# Altium project RegistrationModule.PrjPCB (part 1 of 4)
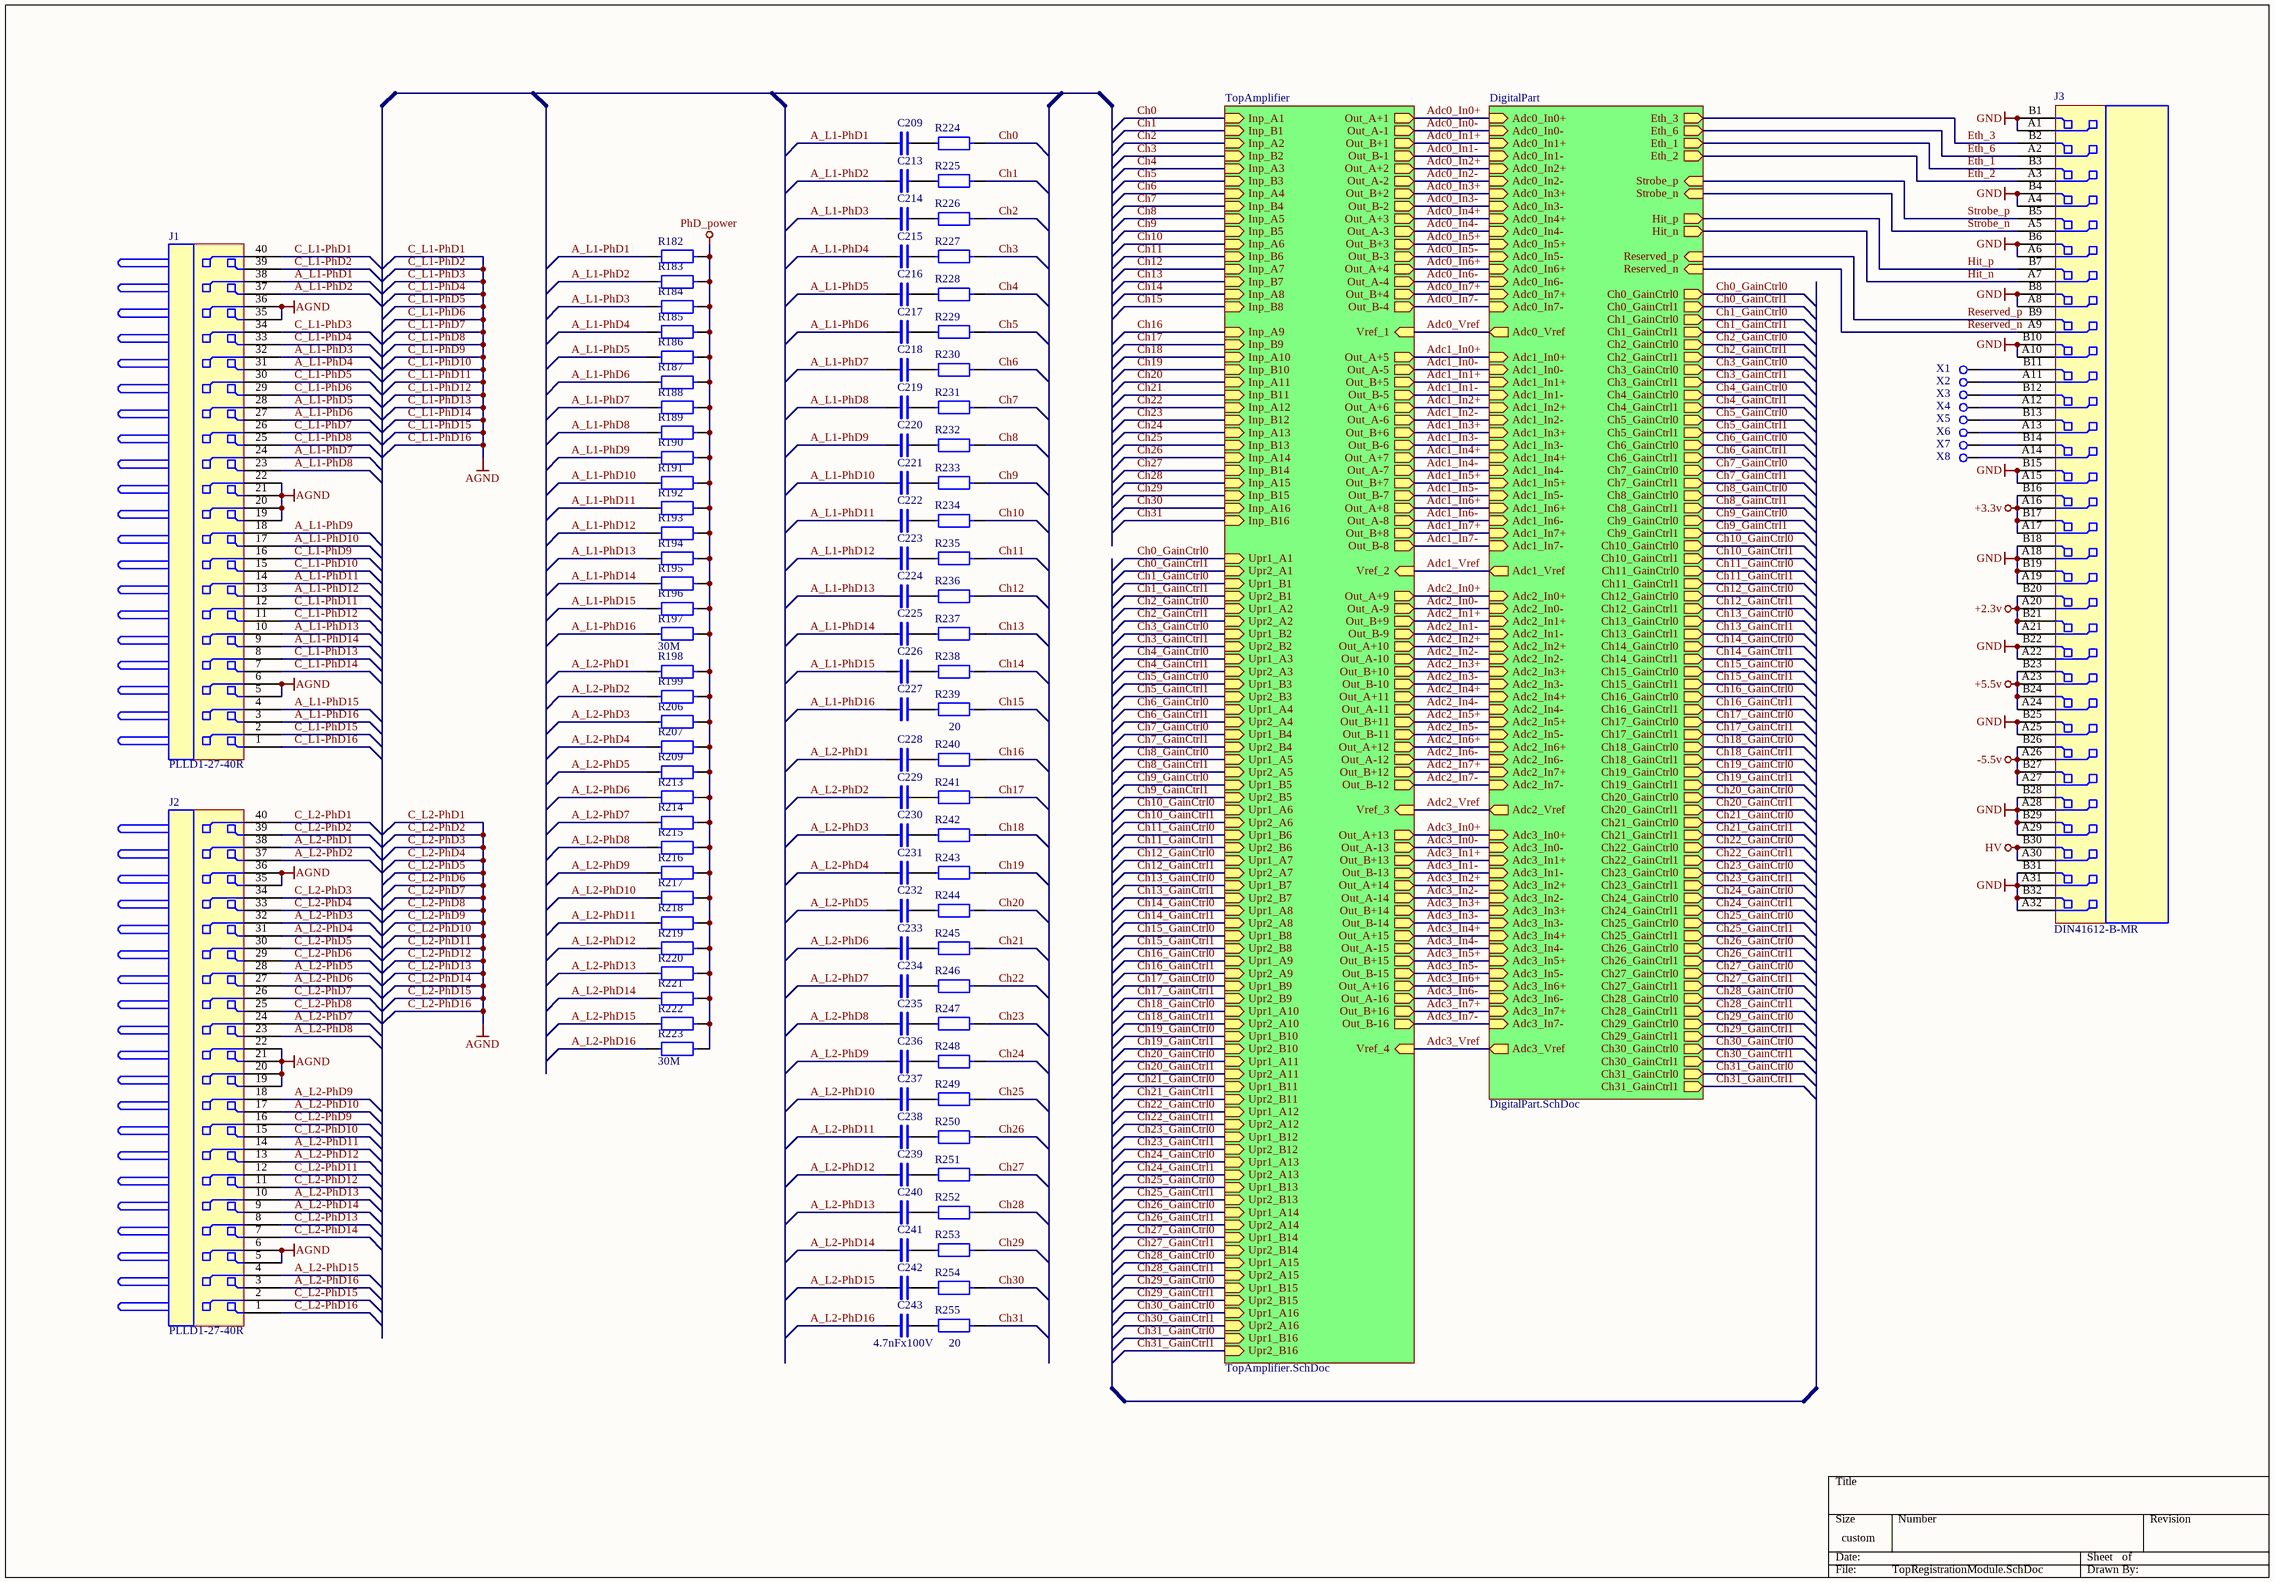
[diagram p0: TopRegistrationModule.SchDoc]
11 sheets, 2487 parts. Net scope: hierarchical (ports join the sheet entries above them; power ports are global).
Board file: RegistrationModule.PcbDoc
Sheets:
  TopRegistrationModule.SchDoc
    DigitalPart = DigitalPart.SchDoc
      Misc = Misc.SchDoc
      PowerMeasure = PowerMeasure.SchDoc
      Nonvolatile RAM = Memory.SchDoc
      ADC_0 = ADC.SchDoc
      ADC_1 = ADC.SchDoc
      ADC_2 = ADC.SchDoc
      ADC_3 = ADC.SchDoc
      Power = Power.SchDoc
      FPGA = FPGA.SchDoc
      Ethernet = Ethernet.SchDoc
    TopAmplifier = TopAmplifier.SchDoc
      CH1 = Amplifier2ch.SchDoc
      CH2 = Amplifier2ch.SchDoc
      CH3 = Amplifier2ch.SchDoc
      CH4 = Amplifier2ch.SchDoc
      CH5 = Amplifier2ch.SchDoc
      CH6 = Amplifier2ch.SchDoc
      CH7 = Amplifier2ch.SchDoc
      CH8 = Amplifier2ch.SchDoc
      CH9 = Amplifier2ch.SchDoc
      CH10 = Amplifier2ch.SchDoc
      CH11 = Amplifier2ch.SchDoc
      CH12 = Amplifier2ch.SchDoc
      CH13 = Amplifier2ch.SchDoc
      CH14 = Amplifier2ch.SchDoc
      CH15 = Amplifier2ch.SchDoc
      CH16 = Amplifier2ch.SchDoc

## Sheet TopRegistrationModule.SchDoc
size 457 x 317 mm

### Parts
C209  4.7nFx100V  [0805]  (value not drawn)
C213  4.7nFx100V  [0805]  (value not drawn)
C214  4.7nFx100V  [0805]  (value not drawn)
C215  4.7nFx100V  [0805]  (value not drawn)
C216  4.7nFx100V  [0805]  (value not drawn)
C217  4.7nFx100V  [0805]  (value not drawn)
C218  4.7nFx100V  [0805]  (value not drawn)
C219  4.7nFx100V  [0805]  (value not drawn)
C220  4.7nFx100V  [0805]  (value not drawn)
C221  4.7nFx100V  [0805]  (value not drawn)
C222  4.7nFx100V  [0805]  (value not drawn)
C223  4.7nFx100V  [0805]  (value not drawn)
C224  4.7nFx100V  [0805]  (value not drawn)
C225  4.7nFx100V  [0805]  (value not drawn)
C226  4.7nFx100V  [0805]  (value not drawn)
C227  4.7nFx100V  [0805]  (value not drawn)
C228  4.7nFx100V  [0805]  (value not drawn)
C229  4.7nFx100V  [0805]  (value not drawn)
C230  4.7nFx100V  [0805]  (value not drawn)
C231  4.7nFx100V  [0805]  (value not drawn)
C232  4.7nFx100V  [0805]  (value not drawn)
C233  4.7nFx100V  [0805]  (value not drawn)
C234  4.7nFx100V  [0805]  (value not drawn)
C235  4.7nFx100V  [0805]  (value not drawn)
C236  4.7nFx100V  [0805]  (value not drawn)
C237  4.7nFx100V  [0805]  (value not drawn)
C238  4.7nFx100V  [0805]  (value not drawn)
C239  4.7nFx100V  [0805]  (value not drawn)
C240  4.7nFx100V  [0805]  (value not drawn)
C241  4.7nFx100V  [0805]  (value not drawn)
C242  4.7nFx100V  [0805]  (value not drawn)
C243  4.7nFx100V  [0805]
J1  PLLD1-27-40R  [PLLD1-27-40R]
J2  PLLD1-27-40R  [PLLD1-27-40R]
J3  DIN41612-B-MR  [DIN41612-B-MR]
R182  30M  [0805]  (value not drawn)
R183  30M  [0805]  (value not drawn)
R184  30M  [0805]  (value not drawn)
R185  30M  [0805]  (value not drawn)
R186  30M  [0805]  (value not drawn)
R187  30M  [0805]  (value not drawn)
R188  30M  [0805]  (value not drawn)
R189  30M  [0805]  (value not drawn)
R190  30M  [0805]  (value not drawn)
R191  30M  [0805]  (value not drawn)
R192  30M  [0805]  (value not drawn)
R193  30M  [0805]  (value not drawn)
R194  30M  [0805]  (value not drawn)
R195  30M  [0805]  (value not drawn)
R196  30M  [0805]  (value not drawn)
R197  30M  [0805]
R198  30M  [0805]  (value not drawn)
R199  30M  [0805]  (value not drawn)
R206  30M  [0805]  (value not drawn)
R207  30M  [0805]  (value not drawn)
R209  30M  [0805]  (value not drawn)
R213  30M  [0805]  (value not drawn)
R214  30M  [0805]  (value not drawn)
R215  30M  [0805]  (value not drawn)
R216  30M  [0805]  (value not drawn)
R217  30M  [0805]  (value not drawn)
R218  30M  [0805]  (value not drawn)
R219  30M  [0805]  (value not drawn)
R220  30M  [0805]  (value not drawn)
R221  30M  [0805]  (value not drawn)
R222  30M  [0805]  (value not drawn)
R223  30M  [0805]
R224  20  [0603]  (value not drawn)
R225  20  [0603]  (value not drawn)
R226  20  [0603]  (value not drawn)
R227  20  [0603]  (value not drawn)
R228  20  [0603]  (value not drawn)
R229  20  [0603]  (value not drawn)
R230  20  [0603]  (value not drawn)
R231  20  [0603]  (value not drawn)
R232  20  [0603]  (value not drawn)
R233  20  [0603]  (value not drawn)
R234  20  [0603]  (value not drawn)
R235  20  [0603]  (value not drawn)
R236  20  [0603]  (value not drawn)
R237  20  [0603]  (value not drawn)
R238  20  [0603]  (value not drawn)
R239  20  [0603]
R240  20  [0603]  (value not drawn)
R241  20  [0603]  (value not drawn)
R242  20  [0603]  (value not drawn)
R243  20  [0603]  (value not drawn)
R244  20  [0603]  (value not drawn)
R245  20  [0603]  (value not drawn)
R246  20  [0603]  (value not drawn)
R247  20  [0603]  (value not drawn)
R248  20  [0603]  (value not drawn)
R249  20  [0603]  (value not drawn)
R250  20  [0603]  (value not drawn)
R251  20  [0603]  (value not drawn)
R252  20  [0603]  (value not drawn)
R253  20  [0603]  (value not drawn)
R254  20  [0603]  (value not drawn)
R255  20  [0603]
X1  TP_nPD  [DRL06]  (value not drawn)
X2  TP_nPD  [DRL06]  (value not drawn)
X3  TP_nPD  [DRL06]  (value not drawn)
X4  TP_nPD  [DRL06]  (value not drawn)
X5  TP_nPD  [DRL06]  (value not drawn)
X6  TP_nPD  [DRL06]  (value not drawn)
X7  TP_nPD  [DRL06]  (value not drawn)
X8  TP_nPD  [DRL06]  (value not drawn)

### Sub-sheets
DigitalPart = DigitalPart.SchDoc: Adc0_In0+ (in), Adc0_In1+ (in), Adc0_In2+ (in), Adc0_In3+ (in), Adc0_In4+ (in), Adc0_In5+ (in), Adc0_In6+ (in), Adc0_In7+ (in), Adc0_Vref (out), Adc0_In0- (in), Adc0_In1- (in), Adc0_In2- (in), Adc0_In3- (in), Adc0_In4- (in), Adc0_In5- (in), Adc0_In6- (in), Adc0_In7- (in), Adc1_In0+ (in), Adc1_In1+ (in), Adc1_In2+ (in), Adc1_In3+ (in), Adc1_In4+ (in), Adc1_In5+ (in), Adc1_In6+ (in), Adc1_In7+ (in), Adc1_Vref (out), Adc1_In0- (in), Adc1_In1- (in), Adc1_In2- (in), Adc1_In3- (in), Adc1_In4- (in), Adc1_In5- (in), Adc1_In6- (in), Adc1_In7- (in), Adc2_In0+ (in), Adc2_In1+ (in), Adc2_In2+ (in), Adc2_In3+ (in), Adc2_In4+ (in), Adc2_In5+ (in), Adc2_In6+ (in), Adc2_In7+ (in), Adc2_Vref (out), Adc2_In0- (in), Adc2_In1- (in), Adc2_In2- (in), Adc2_In3- (in), Adc2_In4- (in), Adc2_In5- (in), Adc2_In6- (in), Adc2_In7- (in), Adc3_In0+ (in), Adc3_In1+ (in), Adc3_In2+ (in), Adc3_In3+ (in), Adc3_In4+ (in), Adc3_In5+ (in), Adc3_In6+ (in), Adc3_In7+ (in), Adc3_Vref (out), Adc3_In0- (in), Adc3_In1- (in), Adc3_In2- (in), Adc3_In3- (in), Adc3_In4- (in), Adc3_In5- (in), Adc3_In6- (in), Adc3_In7- (in), Ch0_GainCtrl0 (out), Ch1_GainCtrl0 (out), Ch2_GainCtrl0 (out), Ch3_GainCtrl0 (out), Ch4_GainCtrl0 (out), Ch5_GainCtrl0 (out), Ch6_GainCtrl0 (out), Ch7_GainCtrl0 (out), Ch8_GainCtrl0 (out), Ch9_GainCtrl0 (out), Ch10_GainCtrl0 (out), Ch11_GainCtrl0 (out), Ch12_GainCtrl0 (out), Ch13_GainCtrl0 (out), Ch14_GainCtrl0 (out), Ch15_GainCtrl0 (out), Ch16_GainCtrl0 (out), Ch17_GainCtrl0 (out), Ch18_GainCtrl0 (out), Ch19_GainCtrl0 (out), Ch20_GainCtrl0 (out), Ch21_GainCtrl0 (out), Ch22_GainCtrl0 (out), Ch23_GainCtrl0 (out), Ch24_GainCtrl0 (out), Ch25_GainCtrl0 (out), Ch26_GainCtrl0 (out), Ch27_GainCtrl0 (out), Ch28_GainCtrl0 (out), Ch29_GainCtrl0 (out), Ch30_GainCtrl0 (out), Ch31_GainCtrl0 (out), Ch0_GainCtrl1 (out), Ch1_GainCtrl1 (out), Ch2_GainCtrl1 (out), Ch3_GainCtrl1 (out), Ch4_GainCtrl1 (out), Ch5_GainCtrl1 (out), Ch6_GainCtrl1 (out), Ch7_GainCtrl1 (out), Ch8_GainCtrl1 (out), Ch9_GainCtrl1 (out), Ch10_GainCtrl1 (out), Ch11_GainCtrl1 (out), Ch12_GainCtrl1 (out), Ch13_GainCtrl1 (out), Ch14_GainCtrl1 (out), Ch15_GainCtrl1 (out), Ch16_GainCtrl1 (out), Ch17_GainCtrl1 (out), Ch18_GainCtrl1 (out), Ch19_GainCtrl1 (out), Ch20_GainCtrl1 (out), Ch21_GainCtrl1 (out), Ch22_GainCtrl1 (out), Ch23_GainCtrl1 (out), Ch24_GainCtrl1 (out), Ch25_GainCtrl1 (out), Ch26_GainCtrl1 (out), Ch27_GainCtrl1 (out), Ch28_GainCtrl1 (out), Ch29_GainCtrl1 (out), Ch30_GainCtrl1 (out), Ch31_GainCtrl1 (out), Eth_1 (out), Eth_2 (out), Eth_3 (out), Eth_6 (out), Strobe_n (in), Strobe_p (in), Hit_p (out), Hit_n (out), Reserved_p (in), Reserved_n (in)
TopAmplifier = TopAmplifier.SchDoc: Inp_A1 (in), Inp_A2 (in), Inp_A3 (in), Inp_A4 (in), Inp_A5 (in), Inp_A6 (in), Inp_A7 (in), Inp_A8 (in), Inp_A9 (in), Inp_A10 (in), Inp_A11 (in), Inp_A12 (in), Inp_A13 (in), Inp_A14 (in), Inp_A15 (in), Inp_A16 (in), Inp_B1 (in), Inp_B2 (in), Inp_B3 (in), Inp_B4 (in), Inp_B5 (in), Inp_B6 (in), Inp_B7 (in), Inp_B8 (in), Inp_B9 (in), Inp_B10 (in), Inp_B11 (in), Inp_B12 (in), Inp_B13 (in), Inp_B14 (in), Inp_B15 (in), Inp_B16 (in), Vref_1 (in), Vref_2 (in), Vref_3 (in), Vref_4 (in), Out_A+1 (out), Out_A+2 (out), Out_A+3 (out), Out_A+4 (out), Out_A+5 (out), Out_A+6 (out), Out_A+7 (out), Out_A+8 (out), Out_A+9 (out), Out_A+10 (out), Out_A+11 (out), Out_A+12 (out), Out_A+13 (out), Out_A+14 (out), Out_A+15 (out), Out_A+16 (out), Out_A-1 (out), Out_A-2 (out), Out_A-3 (out), Out_A-4 (out), Out_A-5 (out), Out_A-6 (out), Out_A-7 (out), Out_A-8 (out), Out_A-9 (out), Out_A-10 (out), Out_A-11 (out), Out_A-12 (out), Out_A-13 (out), Out_A-14 (out), Out_A-15 (out), Out_A-16 (out), Out_B+1 (out), Out_B+2 (out), Out_B+3 (out), Out_B+4 (out), Out_B+5 (out), Out_B+6 (out), Out_B+7 (out), Out_B+8 (out), Out_B+9 (out), Out_B+10 (out), Out_B+11 (out), Out_B+12 (out), Out_B+13 (out), Out_B+14 (out), Out_B+15 (out), Out_B+16 (out), Out_B-1 (out), Out_B-2 (out), Out_B-3 (out), Out_B-4 (out), Out_B-5 (out), Out_B-6 (out), Out_B-7 (out), Out_B-8 (out), Out_B-9 (out), Out_B-10 (out), Out_B-11 (out), Out_B-12 (out), Out_B-13 (out), Out_B-14 (out), Out_B-15 (out), Out_B-16 (out), Upr1_A1 (in), Upr1_A2 (in), Upr1_A3 (in), Upr1_A4 (in), Upr1_A5 (in), Upr1_A6 (in), Upr1_A7 (in), Upr1_A8 (in), Upr1_A9 (in), Upr1_A10 (in), Upr1_A11 (in), Upr1_A12 (in), Upr1_A13 (in), Upr1_A14 (in), Upr1_A15 (in), Upr1_A16 (in), Upr2_A1 (in), Upr2_A2 (in), Upr2_A3 (in), Upr2_A4 (in), Upr2_A5 (in), Upr2_A6 (in), Upr2_A7 (in), Upr2_A8 (in), Upr2_A9 (in), Upr2_A10 (in), Upr2_A11 (in), Upr2_A12 (in), Upr2_A13 (in), Upr2_A14 (in), Upr2_A15 (in), Upr2_A16 (in), Upr1_B1 (in), Upr1_B2 (in), Upr1_B3 (in), Upr1_B4 (in), Upr1_B5 (in), Upr1_B6 (in), Upr1_B7 (in), Upr1_B8 (in), Upr1_B9 (in), Upr1_B10 (in), Upr1_B11 (in), Upr1_B12 (in), Upr1_B13 (in), Upr1_B14 (in), Upr1_B15 (in), Upr1_B16 (in), Upr2_B1 (in), Upr2_B2 (in), Upr2_B3 (in), Upr2_B4 (in), Upr2_B5 (in), Upr2_B6 (in), Upr2_B7 (in), Upr2_B8 (in), Upr2_B9 (in), Upr2_B10 (in), Upr2_B11 (in), Upr2_B12 (in), Upr2_B13 (in), Upr2_B14 (in), Upr2_B15 (in), Upr2_B16 (in)

### Nets
+2.3v: J3.A20 J3.A21 J3.B20 J3.B21
+3.3v: J3.A16 J3.A17 J3.B16 J3.B17
+5.5v: J3.A23 J3.A24 J3.B23 J3.B24
-5.5v: J3.A26 J3.A27 J3.B26 J3.B27
C_L1-PhD1: J1.1 J1.2 J1.5 J1.6 J1.7 J1.8 J1.11 J1.12 J1.15 J1.16 J1.19 J1.20 J1.21 J1.22 J1.25 J1.26 J1.29 J1.30 J1.33 J1.34 J1.35 J1.36 J1.39 J1.40 J2.1 J2.2 J2.5 J2.6 J2.7 J2.8 J2.11 J2.12 J2.15 J2.16 J2.19 J2.20 J2.21 J2.22 J2.25 J2.26 J2.29 J2.30 J2.33 J2.34 J2.35 J2.36 J2.39 J2.40 J3.A1 J3.A4 J3.A6 J3.A8 J3.A10 J3.A15 J3.A18 J3.A19 J3.A22 J3.A25 J3.A28 J3.A29 J3.A31 J3.A32 J3.B1 J3.B4 J3.B6 J3.B8 J3.B10 J3.B15 J3.B18 J3.B19 J3.B22 J3.B25 J3.B28 J3.B29 J3.B31 J3.B32  [also labelled AGND, C_L1-PhD10, C_L1-PhD11, C_L1-PhD12, C_L1-PhD13, C_L1-PhD14, C_L1-PhD15, C_L1-PhD16, C_L1-PhD2, C_L1-PhD3, C_L1-PhD4, C_L1-PhD5, C_L1-PhD6, C_L1-PhD7, C_L1-PhD8, C_L1-PhD9, C_L2-PhD1, C_L2-PhD10, C_L2-PhD11, C_L2-PhD12, C_L2-PhD13, C_L2-PhD14, C_L2-PhD15, C_L2-PhD16, C_L2-PhD2, C_L2-PhD3, C_L2-PhD4, C_L2-PhD5, C_L2-PhD6, C_L2-PhD7, C_L2-PhD8, C_L2-PhD9, GND]
HV: J3.A30 J3.B30
PhD_power: R182.2 R183.2 R184.2 R185.2 R186.2 R187.2 R188.2 R189.2 R190.2 R191.2 R192.2 R193.2 R194.2 R195.2 R196.2 R197.2 R198.2 R199.2 R206.2 R207.2 R209.2 R213.2 R214.2 R215.2 R216.2 R217.2 R218.2 R219.2 R220.2 R221.2 R222.2 R223.2
A_L1-PhD1: C209.2 J1.38 R182.1
A_L1-PhD2: C213.2 J1.37 R183.1
A_L1-PhD3: C214.2 J1.32 R184.1
A_L1-PhD4: C215.2 J1.31 R185.1
A_L1-PhD5: C216.2 J1.28 R186.1
A_L1-PhD6: C217.2 J1.27 R187.1
A_L1-PhD7: C218.2 J1.24 R188.1
A_L1-PhD8: C219.2 J1.23 R189.1
A_L1-PhD9: C220.2 J1.18 R190.1
A_L1-PhD10: C221.2 J1.17 R191.1
A_L1-PhD11: C222.2 J1.14 R192.1
A_L1-PhD12: C223.2 J1.13 R193.1
A_L1-PhD13: C224.2 J1.10 R194.1
A_L1-PhD14: C225.2 J1.9 R195.1
A_L1-PhD15: C226.2 J1.4 R196.1
A_L1-PhD16: C227.2 J1.3 R197.1
A_L2-PhD1: C228.2 J2.38 R198.1
A_L2-PhD2: C229.2 J2.37 R199.1
A_L2-PhD3: C230.2 J2.32 R206.1
A_L2-PhD4: C231.2 J2.31 R207.1
A_L2-PhD5: C232.2 J2.28 R209.1
A_L2-PhD6: C233.2 J2.27 R213.1
A_L2-PhD7: C234.2 J2.24 R214.1
A_L2-PhD8: C235.2 J2.23 R215.1
A_L2-PhD9: C236.2 J2.18 R216.1
A_L2-PhD10: C237.2 J2.17 R217.1
A_L2-PhD11: C238.2 J2.14 R218.1
A_L2-PhD12: C239.2 J2.13 R219.1
A_L2-PhD13: C240.2 J2.10 R220.1
A_L2-PhD14: C241.2 J2.9 R221.1
A_L2-PhD15: C242.2 J2.4 R222.1
A_L2-PhD16: C243.2 J2.3 R223.1
Adc0_In0+: sheet DigitalPart/Adc0_In0+, sheet TopAmplifier/Out_A+1
Adc0_In0-: sheet DigitalPart/Adc0_In0-, sheet TopAmplifier/Out_A-1
Adc0_In1+: sheet DigitalPart/Adc0_In1+, sheet TopAmplifier/Out_B+1
Adc0_In1-: sheet DigitalPart/Adc0_In1-, sheet TopAmplifier/Out_B-1
Adc0_In2+: sheet DigitalPart/Adc0_In2+, sheet TopAmplifier/Out_A+2
Adc0_In2-: sheet DigitalPart/Adc0_In2-, sheet TopAmplifier/Out_A-2
Adc0_In3+: sheet DigitalPart/Adc0_In3+, sheet TopAmplifier/Out_B+2
Adc0_In3-: sheet DigitalPart/Adc0_In3-, sheet TopAmplifier/Out_B-2
Adc0_In4+: sheet DigitalPart/Adc0_In4+, sheet TopAmplifier/Out_A+3
Adc0_In4-: sheet DigitalPart/Adc0_In4-, sheet TopAmplifier/Out_A-3
Adc0_In5+: sheet DigitalPart/Adc0_In5+, sheet TopAmplifier/Out_B+3
Adc0_In5-: sheet DigitalPart/Adc0_In5-, sheet TopAmplifier/Out_B-3
Adc0_In6+: sheet DigitalPart/Adc0_In6+, sheet TopAmplifier/Out_A+4
Adc0_In6-: sheet DigitalPart/Adc0_In6-, sheet TopAmplifier/Out_A-4
Adc0_In7+: sheet DigitalPart/Adc0_In7+, sheet TopAmplifier/Out_B+4
Adc0_In7-: sheet DigitalPart/Adc0_In7-, sheet TopAmplifier/Out_B-4
Adc0_Vref: sheet DigitalPart/Adc0_Vref, sheet TopAmplifier/Vref_1
Adc1_In0+: sheet DigitalPart/Adc1_In0+, sheet TopAmplifier/Out_A+5
Adc1_In0-: sheet DigitalPart/Adc1_In0-, sheet TopAmplifier/Out_A-5
Adc1_In1+: sheet DigitalPart/Adc1_In1+, sheet TopAmplifier/Out_B+5
Adc1_In1-: sheet DigitalPart/Adc1_In1-, sheet TopAmplifier/Out_B-5
Adc1_In2+: sheet DigitalPart/Adc1_In2+, sheet TopAmplifier/Out_A+6
Adc1_In2-: sheet DigitalPart/Adc1_In2-, sheet TopAmplifier/Out_A-6
Adc1_In3+: sheet DigitalPart/Adc1_In3+, sheet TopAmplifier/Out_B+6
Adc1_In3-: sheet DigitalPart/Adc1_In3-, sheet TopAmplifier/Out_B-6
Adc1_In4+: sheet DigitalPart/Adc1_In4+, sheet TopAmplifier/Out_A+7
Adc1_In4-: sheet DigitalPart/Adc1_In4-, sheet TopAmplifier/Out_A-7
Adc1_In5+: sheet DigitalPart/Adc1_In5+, sheet TopAmplifier/Out_B+7
Adc1_In5-: sheet DigitalPart/Adc1_In5-, sheet TopAmplifier/Out_B-7
Adc1_In6+: sheet DigitalPart/Adc1_In6+, sheet TopAmplifier/Out_A+8
Adc1_In6-: sheet DigitalPart/Adc1_In6-, sheet TopAmplifier/Out_A-8
Adc1_In7+: sheet DigitalPart/Adc1_In7+, sheet TopAmplifier/Out_B+8
Adc1_In7-: sheet DigitalPart/Adc1_In7-, sheet TopAmplifier/Out_B-8
Adc1_Vref: sheet DigitalPart/Adc1_Vref, sheet TopAmplifier/Vref_2
Adc2_In0+: sheet DigitalPart/Adc2_In0+, sheet TopAmplifier/Out_A+9
Adc2_In0-: sheet DigitalPart/Adc2_In0-, sheet TopAmplifier/Out_A-9
Adc2_In1+: sheet DigitalPart/Adc2_In1+, sheet TopAmplifier/Out_B+9
Adc2_In1-: sheet DigitalPart/Adc2_In1-, sheet TopAmplifier/Out_B-9
Adc2_In2+: sheet DigitalPart/Adc2_In2+, sheet TopAmplifier/Out_A+10
Adc2_In2-: sheet DigitalPart/Adc2_In2-, sheet TopAmplifier/Out_A-10
Adc2_In3+: sheet DigitalPart/Adc2_In3+, sheet TopAmplifier/Out_B+10
Adc2_In3-: sheet DigitalPart/Adc2_In3-, sheet TopAmplifier/Out_B-10
Adc2_In4+: sheet DigitalPart/Adc2_In4+, sheet TopAmplifier/Out_A+11
Adc2_In4-: sheet DigitalPart/Adc2_In4-, sheet TopAmplifier/Out_A-11
Adc2_In5+: sheet DigitalPart/Adc2_In5+, sheet TopAmplifier/Out_B+11
Adc2_In5-: sheet DigitalPart/Adc2_In5-, sheet TopAmplifier/Out_B-11
Adc2_In6+: sheet DigitalPart/Adc2_In6+, sheet TopAmplifier/Out_A+12
Adc2_In6-: sheet DigitalPart/Adc2_In6-, sheet TopAmplifier/Out_A-12
Adc2_In7+: sheet DigitalPart/Adc2_In7+, sheet TopAmplifier/Out_B+12
Adc2_In7-: sheet DigitalPart/Adc2_In7-, sheet TopAmplifier/Out_B-12
Adc2_Vref: sheet DigitalPart/Adc2_Vref, sheet TopAmplifier/Vref_3
Adc3_In0+: sheet DigitalPart/Adc3_In0+, sheet TopAmplifier/Out_A+13
Adc3_In0-: sheet DigitalPart/Adc3_In0-, sheet TopAmplifier/Out_A-13
Adc3_In1+: sheet DigitalPart/Adc3_In1+, sheet TopAmplifier/Out_B+13
Adc3_In1-: sheet DigitalPart/Adc3_In1-, sheet TopAmplifier/Out_B-13
Adc3_In2+: sheet DigitalPart/Adc3_In2+, sheet TopAmplifier/Out_A+14
Adc3_In2-: sheet DigitalPart/Adc3_In2-, sheet TopAmplifier/Out_A-14
Adc3_In3+: sheet DigitalPart/Adc3_In3+, sheet TopAmplifier/Out_B+14
Adc3_In3-: sheet DigitalPart/Adc3_In3-, sheet TopAmplifier/Out_B-14
Adc3_In4+: sheet DigitalPart/Adc3_In4+, sheet TopAmplifier/Out_A+15
Adc3_In4-: sheet DigitalPart/Adc3_In4-, sheet TopAmplifier/Out_A-15
Adc3_In5+: sheet DigitalPart/Adc3_In5+, sheet TopAmplifier/Out_B+15
Adc3_In5-: sheet DigitalPart/Adc3_In5-, sheet TopAmplifier/Out_B-15
Adc3_In6+: sheet DigitalPart/Adc3_In6+, sheet TopAmplifier/Out_A+16
Adc3_In6-: sheet DigitalPart/Adc3_In6-, sheet TopAmplifier/Out_A-16
Adc3_In7+: sheet DigitalPart/Adc3_In7+, sheet TopAmplifier/Out_B+16
Adc3_In7-: sheet DigitalPart/Adc3_In7-, sheet TopAmplifier/Out_B-16
Adc3_Vref: sheet DigitalPart/Adc3_Vref, sheet TopAmplifier/Vref_4
Ch0: R224.2 ; sheet TopAmplifier/Inp_A1
Ch0_GainCtrl0: sheet DigitalPart/Ch0_GainCtrl0, sheet TopAmplifier/Upr1_A1
Ch0_GainCtrl1: sheet DigitalPart/Ch0_GainCtrl1, sheet TopAmplifier/Upr2_A1
Ch1: R225.2 ; sheet TopAmplifier/Inp_B1
Ch1_GainCtrl0: sheet DigitalPart/Ch1_GainCtrl0, sheet TopAmplifier/Upr1_B1
Ch1_GainCtrl1: sheet DigitalPart/Ch1_GainCtrl1, sheet TopAmplifier/Upr2_B1
Ch2: R226.2 ; sheet TopAmplifier/Inp_A2
Ch2_GainCtrl0: sheet DigitalPart/Ch2_GainCtrl0, sheet TopAmplifier/Upr1_A2
Ch2_GainCtrl1: sheet DigitalPart/Ch2_GainCtrl1, sheet TopAmplifier/Upr2_A2
Ch3: R227.2 ; sheet TopAmplifier/Inp_B2
Ch3_GainCtrl0: sheet DigitalPart/Ch3_GainCtrl0, sheet TopAmplifier/Upr1_B2
Ch3_GainCtrl1: sheet DigitalPart/Ch3_GainCtrl1, sheet TopAmplifier/Upr2_B2
Ch4: R228.2 ; sheet TopAmplifier/Inp_A3
Ch4_GainCtrl0: sheet DigitalPart/Ch4_GainCtrl0, sheet TopAmplifier/Upr1_A3
Ch4_GainCtrl1: sheet DigitalPart/Ch4_GainCtrl1, sheet TopAmplifier/Upr2_A3
Ch5: R229.2 ; sheet TopAmplifier/Inp_B3
Ch5_GainCtrl0: sheet DigitalPart/Ch5_GainCtrl0, sheet TopAmplifier/Upr1_B3
Ch5_GainCtrl1: sheet DigitalPart/Ch5_GainCtrl1, sheet TopAmplifier/Upr2_B3
Ch6: R230.2 ; sheet TopAmplifier/Inp_A4
Ch6_GainCtrl0: sheet DigitalPart/Ch6_GainCtrl0, sheet TopAmplifier/Upr1_A4
Ch6_GainCtrl1: sheet DigitalPart/Ch6_GainCtrl1, sheet TopAmplifier/Upr2_A4
Ch7: R231.2 ; sheet TopAmplifier/Inp_B4
Ch7_GainCtrl0: sheet DigitalPart/Ch7_GainCtrl0, sheet TopAmplifier/Upr1_B4
Ch7_GainCtrl1: sheet DigitalPart/Ch7_GainCtrl1, sheet TopAmplifier/Upr2_B4
Ch8: R232.2 ; sheet TopAmplifier/Inp_A5
Ch8_GainCtrl0: sheet DigitalPart/Ch8_GainCtrl0, sheet TopAmplifier/Upr1_A5
Ch8_GainCtrl1: sheet DigitalPart/Ch8_GainCtrl1, sheet TopAmplifier/Upr2_A5
Ch9: R233.2 ; sheet TopAmplifier/Inp_B5
Ch9_GainCtrl0: sheet DigitalPart/Ch9_GainCtrl0, sheet TopAmplifier/Upr1_B5
Ch9_GainCtrl1: sheet DigitalPart/Ch9_GainCtrl1, sheet TopAmplifier/Upr2_B5
Ch10: R234.2 ; sheet TopAmplifier/Inp_A6
Ch10_GainCtrl0: sheet DigitalPart/Ch10_GainCtrl0, sheet TopAmplifier/Upr1_A6
Ch10_GainCtrl1: sheet DigitalPart/Ch10_GainCtrl1, sheet TopAmplifier/Upr2_A6
Ch11: R235.2 ; sheet TopAmplifier/Inp_B6
Ch11_GainCtrl0: sheet DigitalPart/Ch11_GainCtrl0, sheet TopAmplifier/Upr1_B6
Ch11_GainCtrl1: sheet DigitalPart/Ch11_GainCtrl1, sheet TopAmplifier/Upr2_B6
Ch12: R236.2 ; sheet TopAmplifier/Inp_A7
Ch12_GainCtrl0: sheet DigitalPart/Ch12_GainCtrl0, sheet TopAmplifier/Upr1_A7
Ch12_GainCtrl1: sheet DigitalPart/Ch12_GainCtrl1, sheet TopAmplifier/Upr2_A7
Ch13: R237.2 ; sheet TopAmplifier/Inp_B7
Ch13_GainCtrl0: sheet DigitalPart/Ch13_GainCtrl0, sheet TopAmplifier/Upr1_B7
Ch13_GainCtrl1: sheet DigitalPart/Ch13_GainCtrl1, sheet TopAmplifier/Upr2_B7
Ch14: R238.2 ; sheet TopAmplifier/Inp_A8
Ch14_GainCtrl0: sheet DigitalPart/Ch14_GainCtrl0, sheet TopAmplifier/Upr1_A8
Ch14_GainCtrl1: sheet DigitalPart/Ch14_GainCtrl1, sheet TopAmplifier/Upr2_A8
Ch15: R239.2 ; sheet TopAmplifier/Inp_B8
Ch15_GainCtrl0: sheet DigitalPart/Ch15_GainCtrl0, sheet TopAmplifier/Upr1_B8
Ch15_GainCtrl1: sheet DigitalPart/Ch15_GainCtrl1, sheet TopAmplifier/Upr2_B8
Ch16: R240.2 ; sheet TopAmplifier/Inp_A9
Ch16_GainCtrl0: sheet DigitalPart/Ch16_GainCtrl0, sheet TopAmplifier/Upr1_A9
Ch16_GainCtrl1: sheet DigitalPart/Ch16_GainCtrl1, sheet TopAmplifier/Upr2_A9
Ch17: R241.2 ; sheet TopAmplifier/Inp_B9
Ch17_GainCtrl0: sheet DigitalPart/Ch17_GainCtrl0, sheet TopAmplifier/Upr1_B9
Ch17_GainCtrl1: sheet DigitalPart/Ch17_GainCtrl1, sheet TopAmplifier/Upr2_B9
Ch18: R242.2 ; sheet TopAmplifier/Inp_A10
Ch18_GainCtrl0: sheet DigitalPart/Ch18_GainCtrl0, sheet TopAmplifier/Upr1_A10
Ch18_GainCtrl1: sheet DigitalPart/Ch18_GainCtrl1, sheet TopAmplifier/Upr2_A10
Ch19: R243.2 ; sheet TopAmplifier/Inp_B10
Ch19_GainCtrl0: sheet DigitalPart/Ch19_GainCtrl0, sheet TopAmplifier/Upr1_B10
Ch19_GainCtrl1: sheet DigitalPart/Ch19_GainCtrl1, sheet TopAmplifier/Upr2_B10
Ch20: R244.2 ; sheet TopAmplifier/Inp_A11
Ch20_GainCtrl0: sheet DigitalPart/Ch20_GainCtrl0, sheet TopAmplifier/Upr1_A11
Ch20_GainCtrl1: sheet DigitalPart/Ch20_GainCtrl1, sheet TopAmplifier/Upr2_A11
Ch21: R245.2 ; sheet TopAmplifier/Inp_B11
Ch21_GainCtrl0: sheet DigitalPart/Ch21_GainCtrl0, sheet TopAmplifier/Upr1_B11
Ch21_GainCtrl1: sheet DigitalPart/Ch21_GainCtrl1, sheet TopAmplifier/Upr2_B11
Ch22: R246.2 ; sheet TopAmplifier/Inp_A12
Ch22_GainCtrl0: sheet DigitalPart/Ch22_GainCtrl0, sheet TopAmplifier/Upr1_A12
Ch22_GainCtrl1: sheet DigitalPart/Ch22_GainCtrl1, sheet TopAmplifier/Upr2_A12
Ch23: R247.2 ; sheet TopAmplifier/Inp_B12
Ch23_GainCtrl0: sheet DigitalPart/Ch23_GainCtrl0, sheet TopAmplifier/Upr1_B12
Ch23_GainCtrl1: sheet DigitalPart/Ch23_GainCtrl1, sheet TopAmplifier/Upr2_B12
Ch24: R248.2 ; sheet TopAmplifier/Inp_A13
Ch24_GainCtrl0: sheet DigitalPart/Ch24_GainCtrl0, sheet TopAmplifier/Upr1_A13
Ch24_GainCtrl1: sheet DigitalPart/Ch24_GainCtrl1, sheet TopAmplifier/Upr2_A13
Ch25: R249.2 ; sheet TopAmplifier/Inp_B13
Ch25_GainCtrl0: sheet DigitalPart/Ch25_GainCtrl0, sheet TopAmplifier/Upr1_B13
Ch25_GainCtrl1: sheet DigitalPart/Ch25_GainCtrl1, sheet TopAmplifier/Upr2_B13
Ch26: R250.2 ; sheet TopAmplifier/Inp_A14
Ch26_GainCtrl0: sheet DigitalPart/Ch26_GainCtrl0, sheet TopAmplifier/Upr1_A14
Ch26_GainCtrl1: sheet DigitalPart/Ch26_GainCtrl1, sheet TopAmplifier/Upr2_A14
Ch27: R251.2 ; sheet TopAmplifier/Inp_B14
Ch27_GainCtrl0: sheet DigitalPart/Ch27_GainCtrl0, sheet TopAmplifier/Upr1_B14
Ch27_GainCtrl1: sheet DigitalPart/Ch27_GainCtrl1, sheet TopAmplifier/Upr2_B14
Ch28: R252.2 ; sheet TopAmplifier/Inp_A15
Ch28_GainCtrl0: sheet DigitalPart/Ch28_GainCtrl0, sheet TopAmplifier/Upr1_A15
Ch28_GainCtrl1: sheet DigitalPart/Ch28_GainCtrl1, sheet TopAmplifier/Upr2_A15
Ch29: R253.2 ; sheet TopAmplifier/Inp_B15
Ch29_GainCtrl0: sheet DigitalPart/Ch29_GainCtrl0, sheet TopAmplifier/Upr1_B15
Ch29_GainCtrl1: sheet DigitalPart/Ch29_GainCtrl1, sheet TopAmplifier/Upr2_B15
Ch30: R254.2 ; sheet TopAmplifier/Inp_A16
Ch30_GainCtrl0: sheet DigitalPart/Ch30_GainCtrl0, sheet TopAmplifier/Upr1_A16
Ch30_GainCtrl1: sheet DigitalPart/Ch30_GainCtrl1, sheet TopAmplifier/Upr2_A16
Ch31: R255.2 ; sheet TopAmplifier/Inp_B16
Ch31_GainCtrl0: sheet DigitalPart/Ch31_GainCtrl0, sheet TopAmplifier/Upr1_B16
Ch31_GainCtrl1: sheet DigitalPart/Ch31_GainCtrl1, sheet TopAmplifier/Upr2_B16
Eth_1: J3.B3 ; sheet DigitalPart/Eth_1
Eth_2: J3.A3 ; sheet DigitalPart/Eth_2
Eth_3: J3.B2 ; sheet DigitalPart/Eth_3
Eth_6: J3.A2 ; sheet DigitalPart/Eth_6
Hit_n: J3.A7 ; sheet DigitalPart/Hit_n
Hit_p: J3.B7 ; sheet DigitalPart/Hit_p
Reserved_n: J3.A9 ; sheet DigitalPart/Reserved_n
Reserved_p: J3.B9 ; sheet DigitalPart/Reserved_p
Strobe_n: J3.A5 ; sheet DigitalPart/Strobe_n
Strobe_p: J3.B5 ; sheet DigitalPart/Strobe_p
NetC209_1: C209.1 R224.1
NetC213_1: C213.1 R225.1
NetC214_1: C214.1 R226.1
NetC215_1: C215.1 R227.1
NetC216_1: C216.1 R228.1
NetC217_1: C217.1 R229.1
NetC218_1: C218.1 R230.1
NetC219_1: C219.1 R231.1
NetC220_1: C220.1 R232.1
NetC221_1: C221.1 R233.1
NetC222_1: C222.1 R234.1
NetC223_1: C223.1 R235.1
NetC224_1: C224.1 R236.1
NetC225_1: C225.1 R237.1
NetC226_1: C226.1 R238.1
NetC227_1: C227.1 R239.1
NetC228_1: C228.1 R240.1
NetC229_1: C229.1 R241.1
NetC230_1: C230.1 R242.1
NetC231_1: C231.1 R243.1
NetC232_1: C232.1 R244.1
NetC233_1: C233.1 R245.1
NetC234_1: C234.1 R246.1
NetC235_1: C235.1 R247.1
NetC236_1: C236.1 R248.1
NetC237_1: C237.1 R249.1
NetC238_1: C238.1 R250.1
NetC239_1: C239.1 R251.1
NetC240_1: C240.1 R252.1
NetC241_1: C241.1 R253.1
NetC242_1: C242.1 R254.1
NetC243_1: C243.1 R255.1
NetJ3_A11: J3.A11 X2.DRIL
NetJ3_A12: J3.A12 X4.DRIL
NetJ3_A13: J3.A13 X6.DRIL
NetJ3_A14: J3.A14 X8.DRIL
NetJ3_B11: J3.B11 X1.DRIL
NetJ3_B12: J3.B12 X3.DRIL
NetJ3_B13: J3.B13 X5.DRIL
NetJ3_B14: J3.B14 X7.DRIL

### Library data of the parts
C209 C213-C243 = C
J1 J2 = PLD-40R: Header, double line, 2.54, 2  and 1.27 mm, right angle
R182-R199 R206 R207 R209 R213-R255 = R
X1-X8 = DRL